# EasyEDA schematic 1-Schematic_210 Project Wearable.json
TITLE: HealthLink Wearable Monitor; REV: 1.0; Date: 01/05/2019; Sheet: 1/1; Drawn By: Ian Goodwin
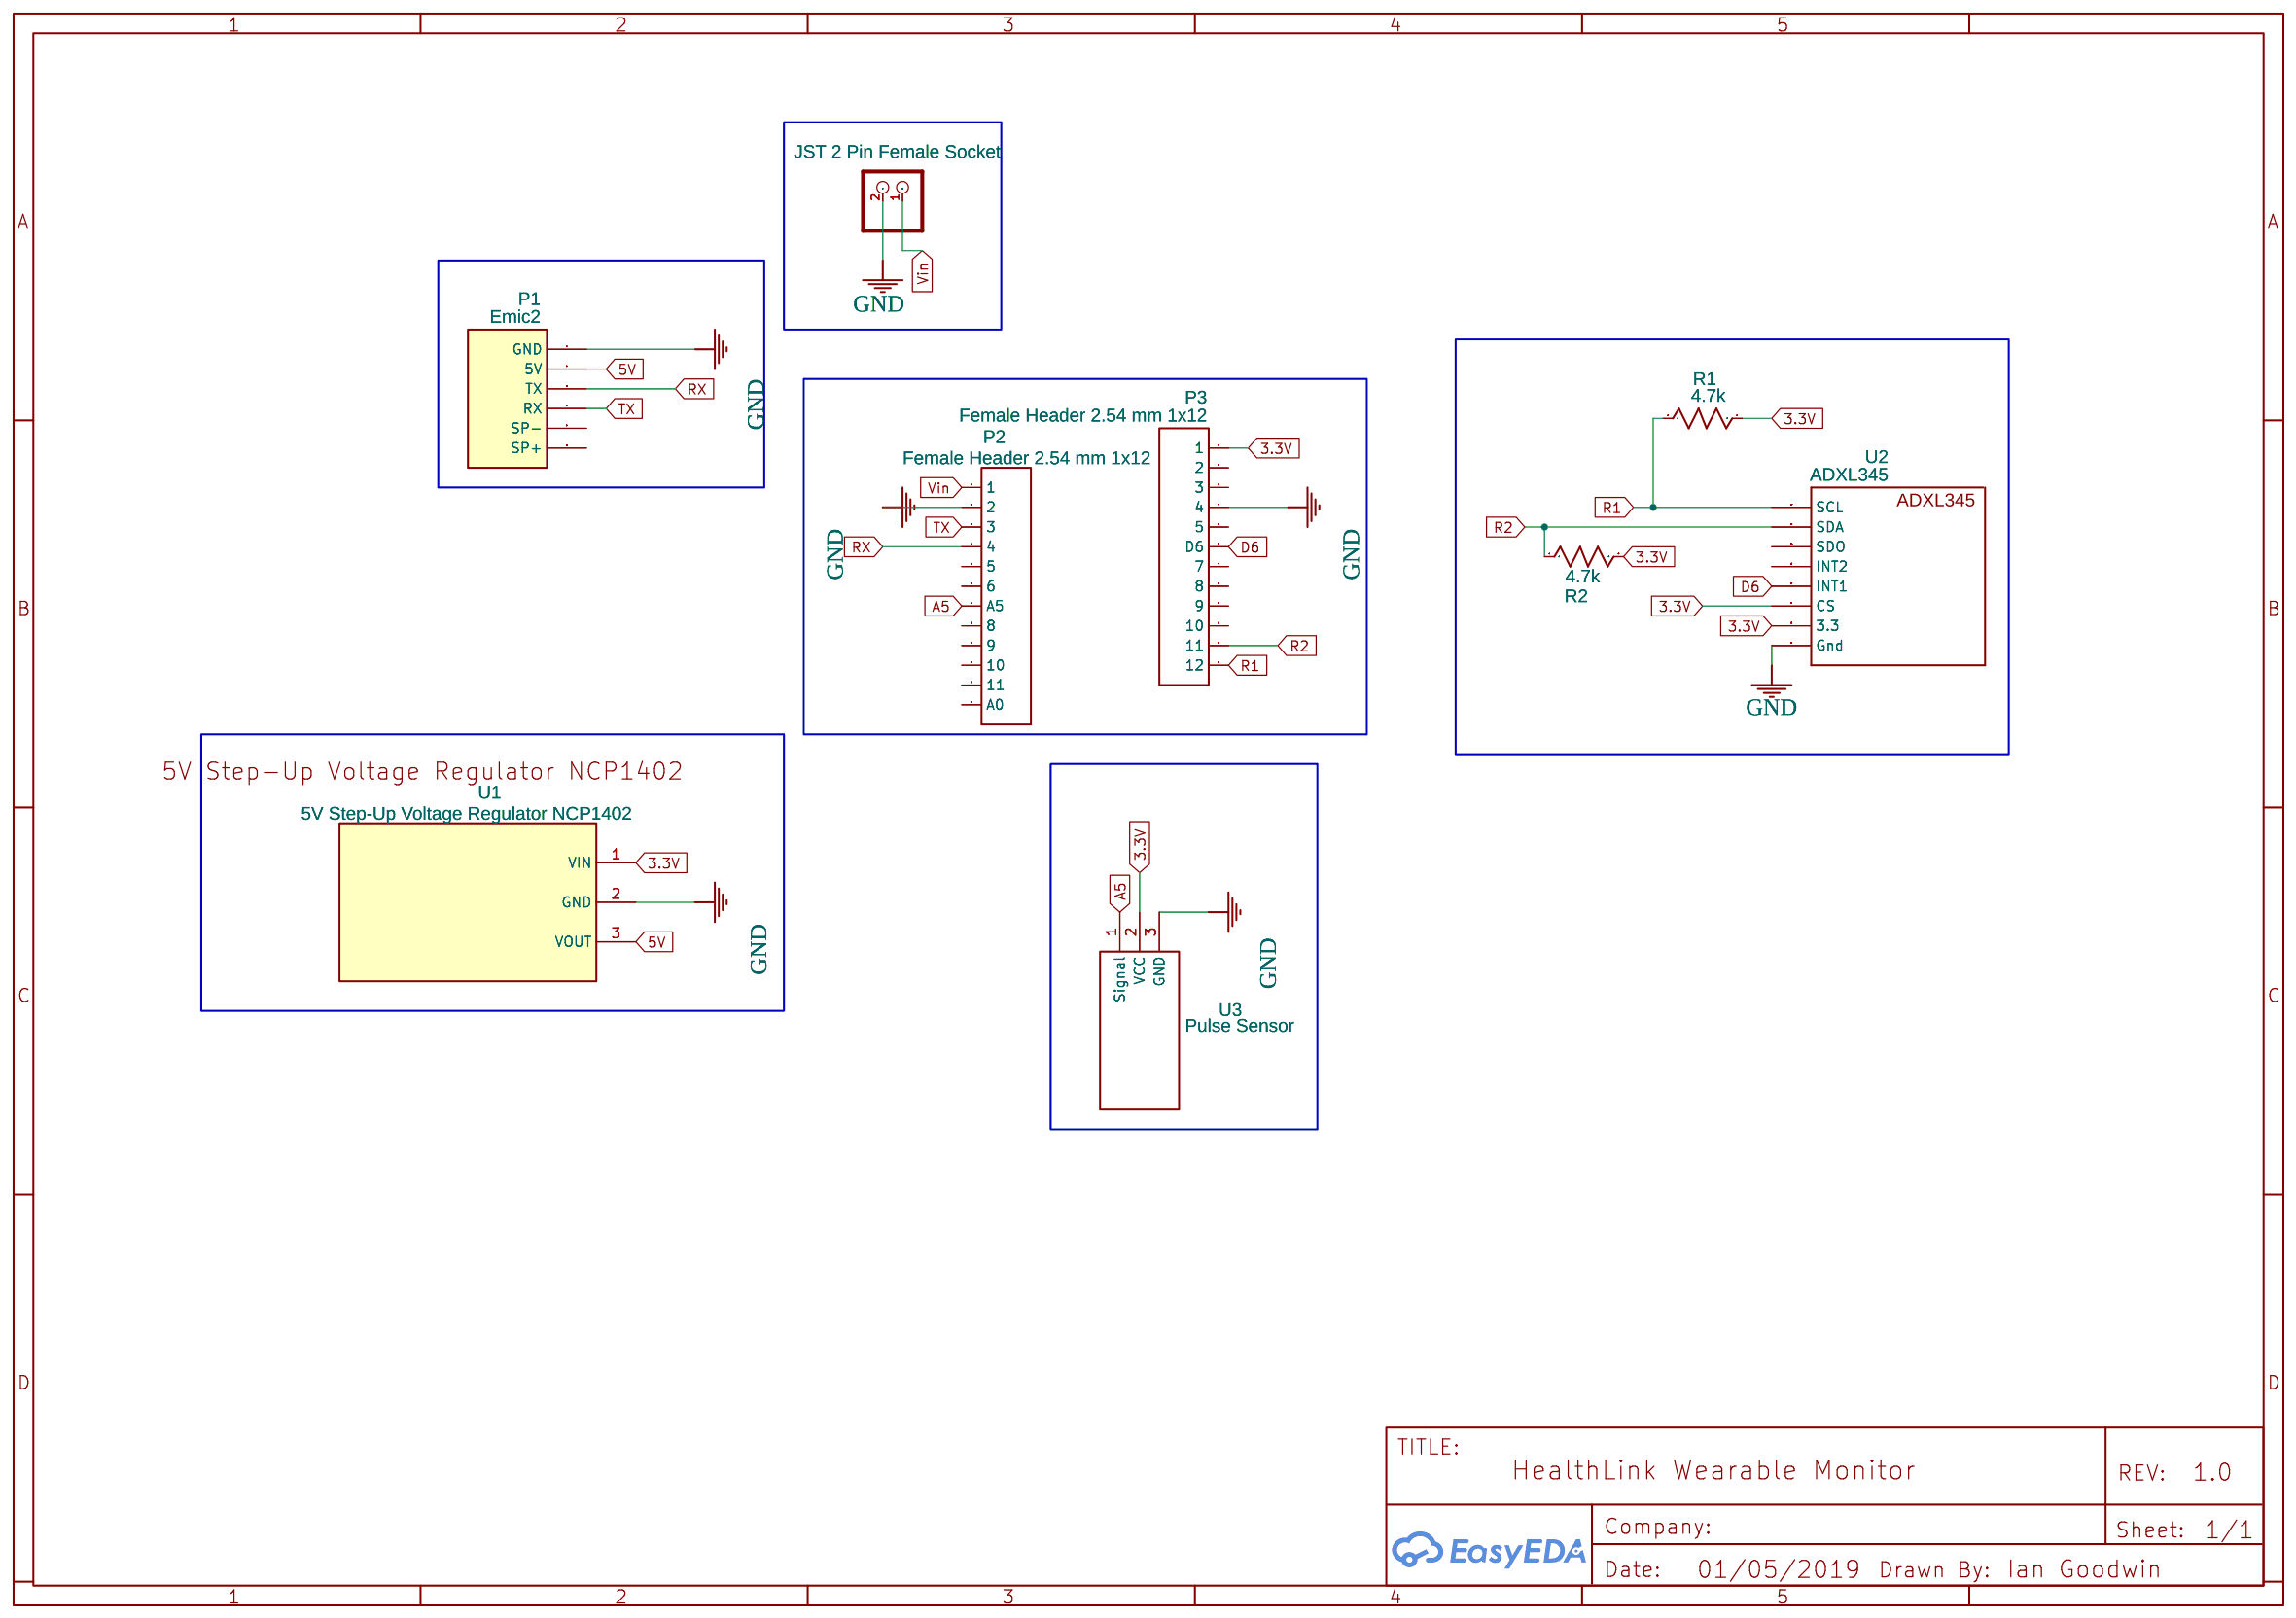
[diagram p0: schematic sheet]

## Parts
CN1  JST 2 Pin Female Socket  [JST-PH-2-THM-RA]
P1  Emic2  [EMIC2 HOFFMANN]
P2  Female Header 2.54 mm 1x12  [HDR-12X1/2.54]
P3  Female Header 2.54 mm 1x12  [HDR-12X1/2.54]
R1  4.7k  [AXIAL-0.3]
R2  4.7k  [AXIAL-0.3]
U1  5V Step-Up Voltage Regulator NCP1402  [5V STEP-UP VOLTAGE REGULATOR NCP1402]
U2  ADXL345  [MODULE ADXL345]
U3  Pulse Sensor  [POLAR]

## Library data of the parts
CN1 = -: JST 2-Pin Connectors of various flavors; Contributor: Adafruit; Manufacturer Part: ?
P1 = -: Supplier Part: C50984; Supplier: LCSC; Manufacturer: LCSC
P2 P3 = -: Manufacturer Part: ?; Contributor: Austin Kidder
R1 R2 = Res_AXIAL-0.3(1/8W)_US: Manufacturer Part: ?
U1 = -: Contributor: winter2015; sourceId: YsmgyP7pj; Manufacturer Part: ?
U2 = -: Manufacturer Part: ?; Contributor: Seaducer
U3 = -: Manufacturer Part: New SchematicLib; Contributor: erikhjertholm

## Nets
3.3V: P3.1 R1.2 R2.2 U1.1(VIN) U2.P$5(3.3) U2.P$7(CS) U3.2(VCC)
5V: P1.2(5V) U1.3(VOUT)
GND: CN1.2(1) P1.1(GND) P2.2 P3.4 U1.2(GND) U2.P$6(Gnd) U3.3(GND)
Vin: CN1.1(2) P2.1
A5: P2.7(A5) U3.1(Signal)
D6: P3.6(D6) U2.P$8(INT1)
R1: P3.12 R1.1 U2.P$12(SCL)
R2: P3.11 R2.1 U2.P$11(SDA)
RX: P1.3(TX) P2.4
TX: P1.4(RX) P2.3

Not connected (* = marked no-connect by the designer): P1 5(SP-) 6(SP+); P2 5 6 8 9 10 11 12(A0); P3 2 3 5 7 8 9 10; U2 P$9(INT2) P$10(SDO)
